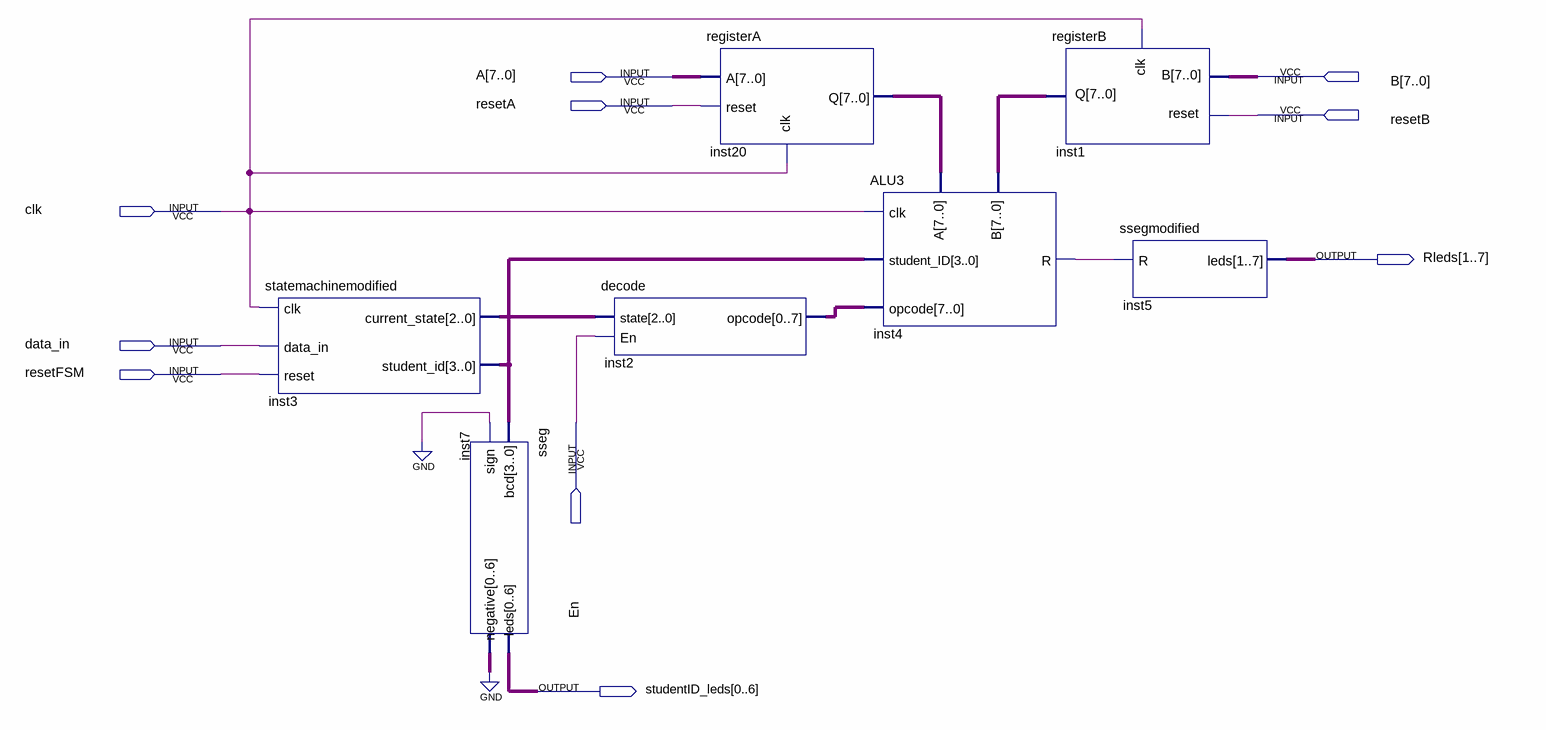
[diagram p0: schematic sheet]
// Quartus schematic lab6block3.bdf as structural Verilog: 7 symbols, 10 pins
module lab6block3 (
  input  [7:0] A,
  input  [7:0] B,
  input  resetA,
  input  resetB,
  input  clk,
  input  data_in,
  input  resetFSM,
  input  En,
  output [1:7] Rleds,
  output [0:6] studentID_leds
);

  wire inst4_r;
  wire [2:0] inst3_current_state;
  wire [3:0] inst3_student_id;
  wire [6:0] inst7_negative;
  wire [7:0] inst1_q, inst2_opcode, inst20_q;

  statemachinemodified inst3 (
    .data_in(data_in), .clk(clk), .reset(resetFSM), .student_id(inst3_student_id),
    .current_state(inst3_current_state));
  sseg inst7 (.bcd(inst3_student_id), .sign(1'b0), .leds(studentID_leds), .negative(inst7_negative));
  decode inst2 (.state(inst3_current_state), .En(En), .opcode(inst2_opcode));
  registerA inst20 (.A(A), .reset(resetA), .clk(clk), .Q(inst20_q));
  ALU3 inst4 (.clk(clk), .student_ID(inst3_student_id), .A(inst20_q), .B(inst1_q), .opcode(inst2_opcode), .R(inst4_r));
  registerB inst1 (.B(B), .reset(resetB), .clk(clk), .Q(inst1_q));
  ssegmodified inst5 (.R(inst4_r), .leds(Rleds));
  // also tied to GND on the sheet: {inst7_negative[0], inst7_negative[1], inst7_negative[2], inst7_negative[3], inst7_negative[4], inst7_negative[5], inst7_negative[6]}
endmodule
